# EAGLE design inc_reg16_custom (EAGLE 5.09)
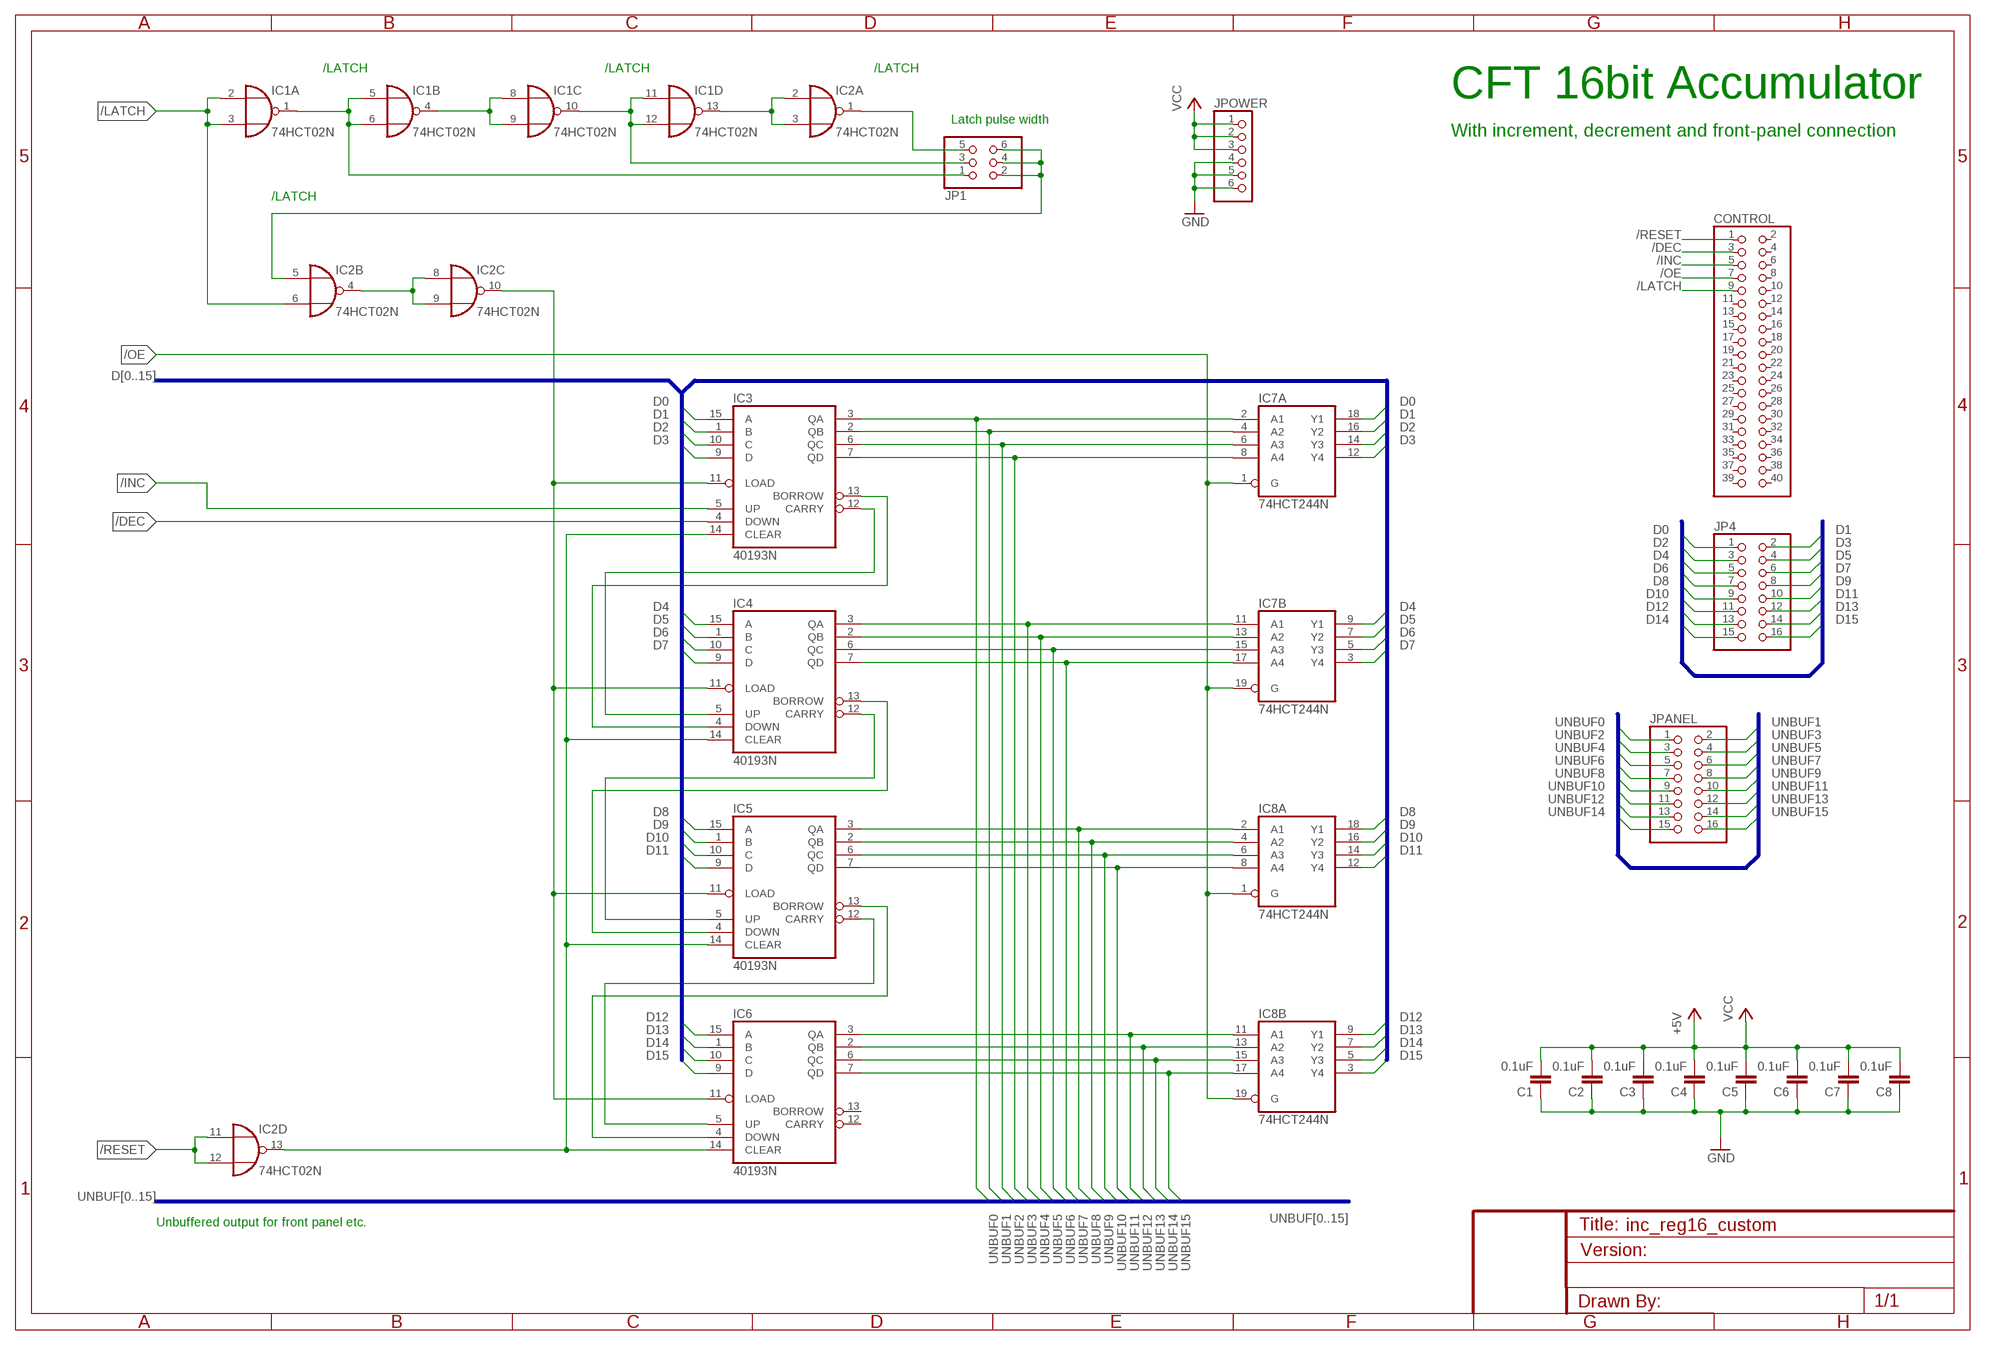
[diagram p0: schematic, sheet 1]

## Parts
C1  0.1uF  C-EU025-024X044  [C025-024X044]
C2  0.1uF  C-EU025-024X044  [C025-024X044]
C3  0.1uF  C-EU025-024X044  [C025-024X044]
C4  0.1uF  C-EU025-024X044  [C025-024X044]
C5  0.1uF  C-EU025-024X044  [C025-024X044]
C6  0.1uF  C-EU025-024X044  [C025-024X044]
C7  0.1uF  C-EU025-024X044  [C025-024X044]
C8  0.1uF  C-EU025-024X044  [C025-024X044]
CONTROL  PINHD-2X20  [2X20]
IC1  74HCT02N  [DIL14]
IC2  74HCT02N  [DIL14]
IC3  40193N  [DIL16]
IC4  40193N  [DIL16]
IC5  40193N  [DIL16]
IC6  40193N  [DIL16]
IC7  74HCT244N  [DIL20]
IC8  74HCT244N  [DIL20]
JP1  PINHD-2X3/90  [2X03/90]
JP4  PINHD-2X8  [2X08]
JPANEL  PINHD-2X8/90  [2X08/90]
JPOWER  PINHD-1X6  [1X06]

## Nets
/DEC: CONTROL.3 IC3.4(DOWN)
/INC: CONTROL.5 IC3.5(UP)
/LATCH: CONTROL.9 IC1.2(A:I0) IC1.3(A:I1) IC2.6(B:I1)
/OE: CONTROL.7 IC7.1(A:G) IC7.19(B:G) IC8.1(A:G) IC8.19(B:G)
/RESET: CONTROL.1 IC2.11(D:I0) IC2.12(D:I1)
D0: IC3.15(A) IC7.18(A:Y1) JP4.1
D1: IC3.1(B) IC7.16(A:Y2) JP4.2
D2: IC3.10(C) IC7.14(A:Y3) JP4.3
D3: IC3.9(D) IC7.12(A:Y4) JP4.4
D4: IC4.15(A) IC7.9(B:Y1) JP4.5
D5: IC4.1(B) IC7.7(B:Y2) JP4.6
D6: IC4.10(C) IC7.5(B:Y3) JP4.7
D7: IC4.9(D) IC7.3(B:Y4) JP4.8
D8: IC5.15(A) IC8.18(A:Y1) JP4.9
D9: IC5.1(B) IC8.16(A:Y2) JP4.10
D10: IC5.10(C) IC8.14(A:Y3) JP4.11
D11: IC5.9(D) IC8.12(A:Y4) JP4.12
D12: IC6.15(A) IC8.9(B:Y1) JP4.13
D13: IC6.1(B) IC8.7(B:Y2) JP4.14
D14: IC6.10(C) IC8.5(B:Y3) JP4.15
D15: IC6.9(D) IC8.3(B:Y4) JP4.16
GND: C1.1 C2.1 C3.1 C4.1 C5.1 C6.1 C7.1 C8.1 JPOWER.4 JPOWER.5 JPOWER.6
N$17: IC1.1(A:O) IC1.5(B:I0) IC1.6(B:I1) JP1.1
N$18: IC1.4(B:O) IC1.8(C:I0) IC1.9(C:I1)
N$19: IC1.10(C:O) IC1.11(D:I0) IC1.12(D:I1) JP1.3
N$20: IC1.13(D:O) IC2.2(A:I0) IC2.3(A:I1)
N$21: IC2.1(A:O) JP1.5
N$22: IC2.5(B:I0) JP1.2 JP1.4 JP1.6
N$23: IC2.4(B:O) IC2.8(C:I0) IC2.9(C:I1)
N$24: IC2.10(C:O) IC3.11(LOAD) IC4.11(LOAD) IC5.11(LOAD) IC6.11(LOAD)
N$25: IC3.12(CARRY) IC4.5(UP)
N$26: IC2.13(D:O) IC3.14(CLEAR) IC4.14(CLEAR) IC5.14(CLEAR) IC6.14(CLEAR)
N$27: IC3.13(BORROW) IC4.4(DOWN)
N$28: IC4.13(BORROW) IC5.4(DOWN)
N$29: IC4.12(CARRY) IC5.5(UP)
N$30: IC5.13(BORROW) IC6.4(DOWN)
N$31: IC5.12(CARRY) IC6.5(UP)
UNBUF0: IC3.3(QA) IC7.2(A:A1)
UNBUF1: IC3.2(QB) IC7.4(A:A2) JPANEL.2
UNBUF2: IC3.6(QC) IC7.6(A:A3) JPANEL.3
UNBUF3: IC3.7(QD) IC7.8(A:A4) JPANEL.4
UNBUF4: IC4.3(QA) IC7.11(B:A1) JPANEL.5
UNBUF5: IC4.2(QB) IC7.13(B:A2) JPANEL.6
UNBUF6: IC4.6(QC) IC7.15(B:A3) JPANEL.7
UNBUF7: IC4.7(QD) IC7.17(B:A4) JPANEL.8
UNBUF8: IC5.3(QA) IC8.2(A:A1) JPANEL.9
UNBUF9: IC5.2(QB) IC8.4(A:A2) JPANEL.10
UNBUF10: IC5.6(QC) IC8.6(A:A3) JPANEL.11
UNBUF11: IC5.7(QD) IC8.8(A:A4) JPANEL.12
UNBUF12: IC6.3(QA) IC8.11(B:A1) JPANEL.13
UNBUF13: IC6.2(QB) IC8.13(B:A2) JPANEL.14
UNBUF14: IC6.6(QC) IC8.15(B:A3) JPANEL.15
UNBUF15: IC6.7(QD) IC8.17(B:A4) JPANEL.16
VCC: C1.2 C2.2 C3.2 C4.2 C5.2 C6.2 C7.2 C8.2 JPOWER.1 JPOWER.2 JPOWER.3 ; supply symbol labelled +5V
Unconnected: CONTROL.2 CONTROL.4 CONTROL.6 CONTROL.8 CONTROL.10 CONTROL.11 CONTROL.12 CONTROL.13 CONTROL.14 CONTROL.15 CONTROL.16 CONTROL.17 CONTROL.18 CONTROL.19 CONTROL.20 CONTROL.21 CONTROL.22 CONTROL.23 CONTROL.24 CONTROL.25 CONTROL.26 CONTROL.27 CONTROL.28 CONTROL.29 CONTROL.30 CONTROL.31 CONTROL.32 CONTROL.33 CONTROL.34 CONTROL.35 CONTROL.36 CONTROL.37 CONTROL.38 CONTROL.39 CONTROL.40 IC6.12(CARRY) IC6.13(BORROW) JPANEL.1

## Buses
D[0..15]
UNBUF[0..15]

## Notes on the sheet
- /LATCH | /LATCH | /LATCH
- CFT 16bit Accumulator
- Latch pulse width
- With increment, decrement and front-panel connection
- /LATCH
- Unbuffered output for front panel etc.

## Power pins joined to a net without a drawn wire
GND: IC1.7(P:GND) IC2.7(P:GND) IC7.10(P:GND) IC8.10(P:GND)
VCC: IC1.14(P:VCC) IC2.14(P:VCC) IC7.20(P:VCC) IC8.20(P:VCC)
VDD: IC3.16(VDD) IC4.16(VDD) IC5.16(VDD) IC6.16(VDD)
VSS: IC3.8(VSS) IC4.8(VSS) IC5.8(VSS) IC6.8(VSS)

## Library data of the parts
C1-C8 = rcl:C-EU: CAPACITOR, European symbol
CONTROL = pinhead:PINHD-2X20: PIN HEADER
IC1 IC2 = 74xx-eu:74*02: Quad 2-input NOR gate
IC3-IC6 = 40xx:40193: Binary up down COUNTER
IC7 IC8 = 74xx-eu:74*244: Octal BUFFER and LINE DRIVER, 3-state
JP1 = pinhead:PINHD-2X3: PIN HEADER
JP4 JPANEL = pinhead:PINHD-2X8: PIN HEADER
JPOWER = pinhead:PINHD-1X6: PIN HEADER

## Board
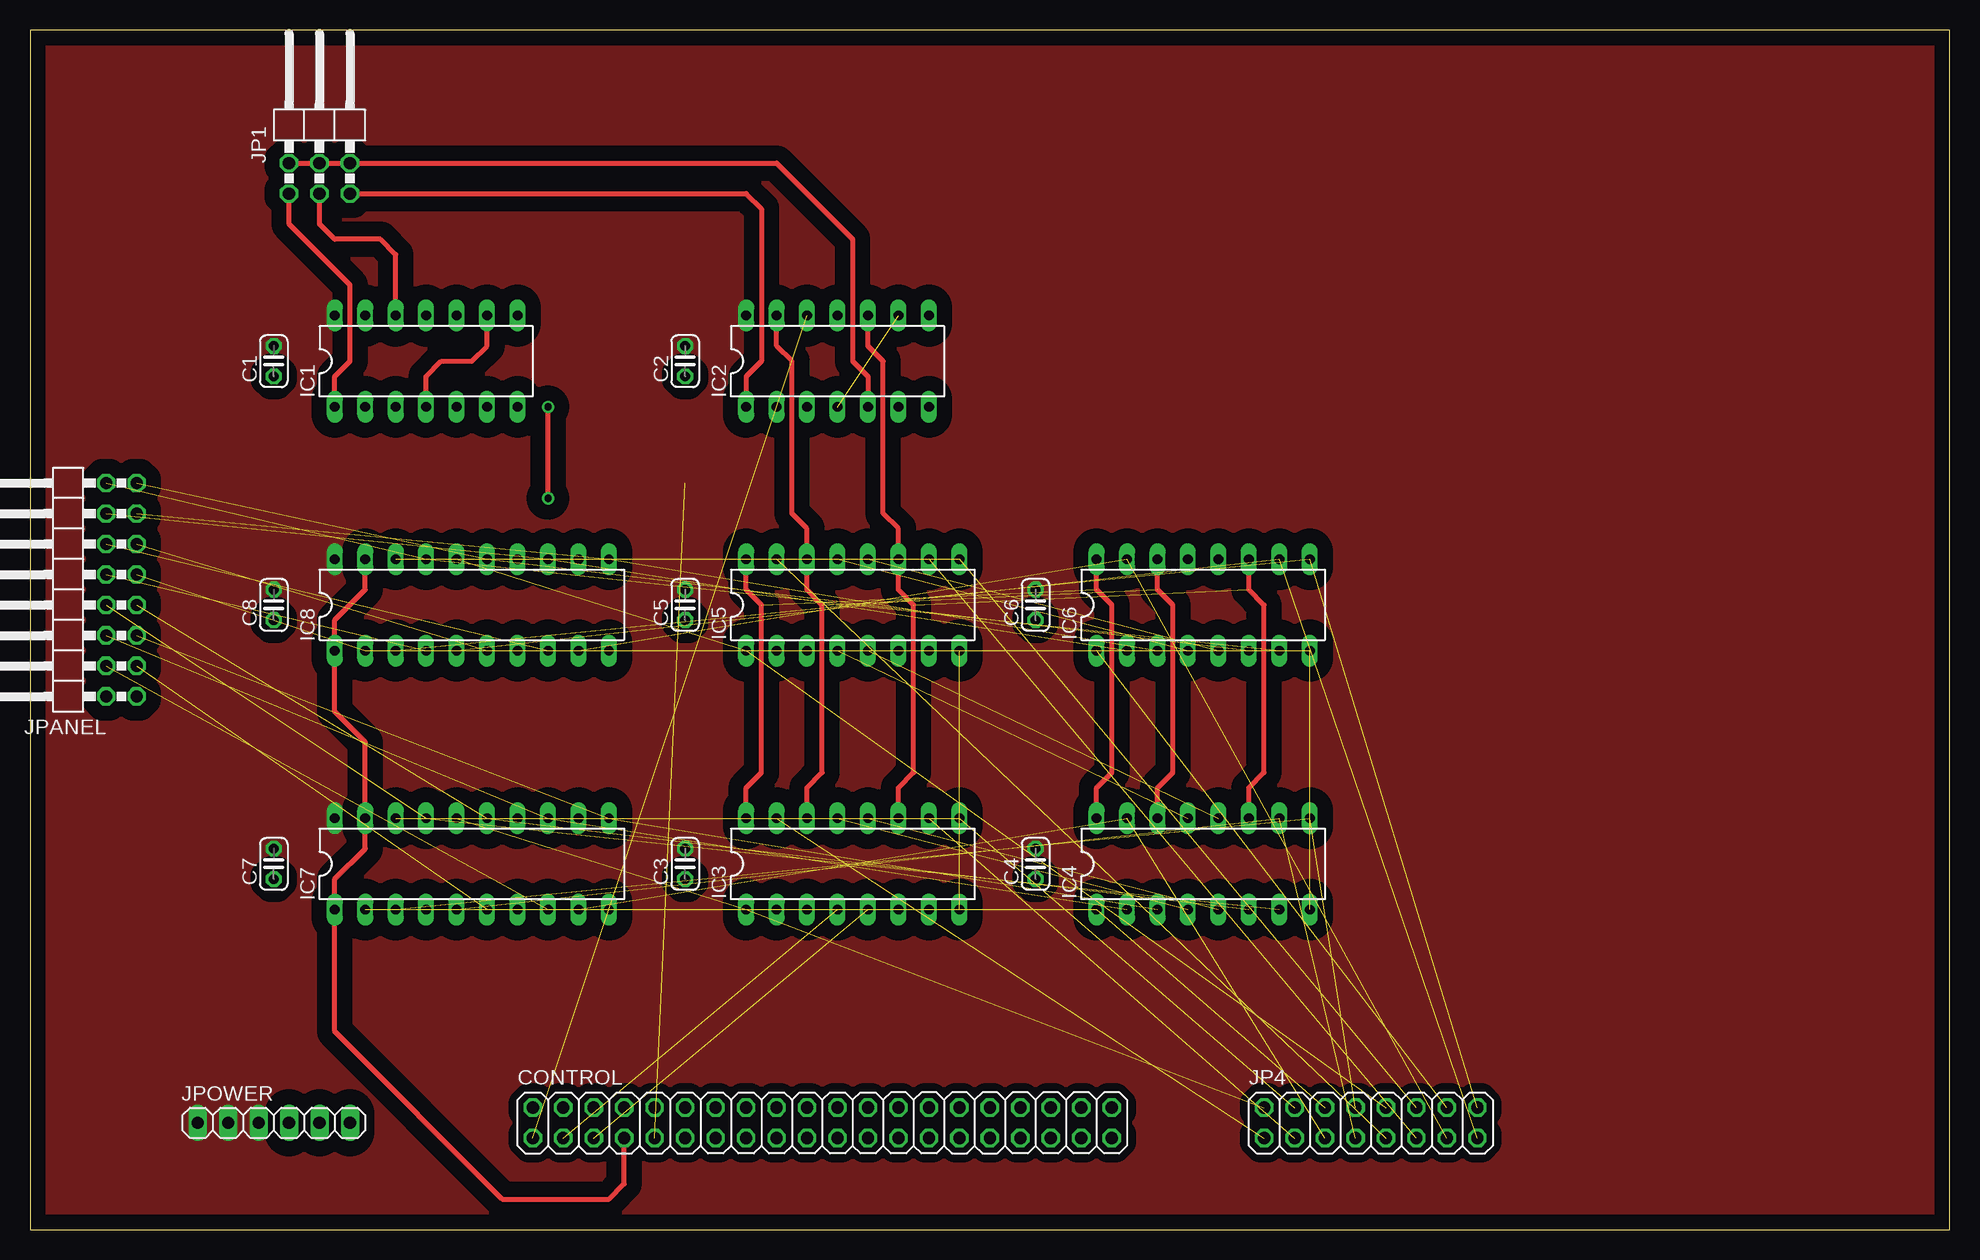
[diagram p1: board, top side]
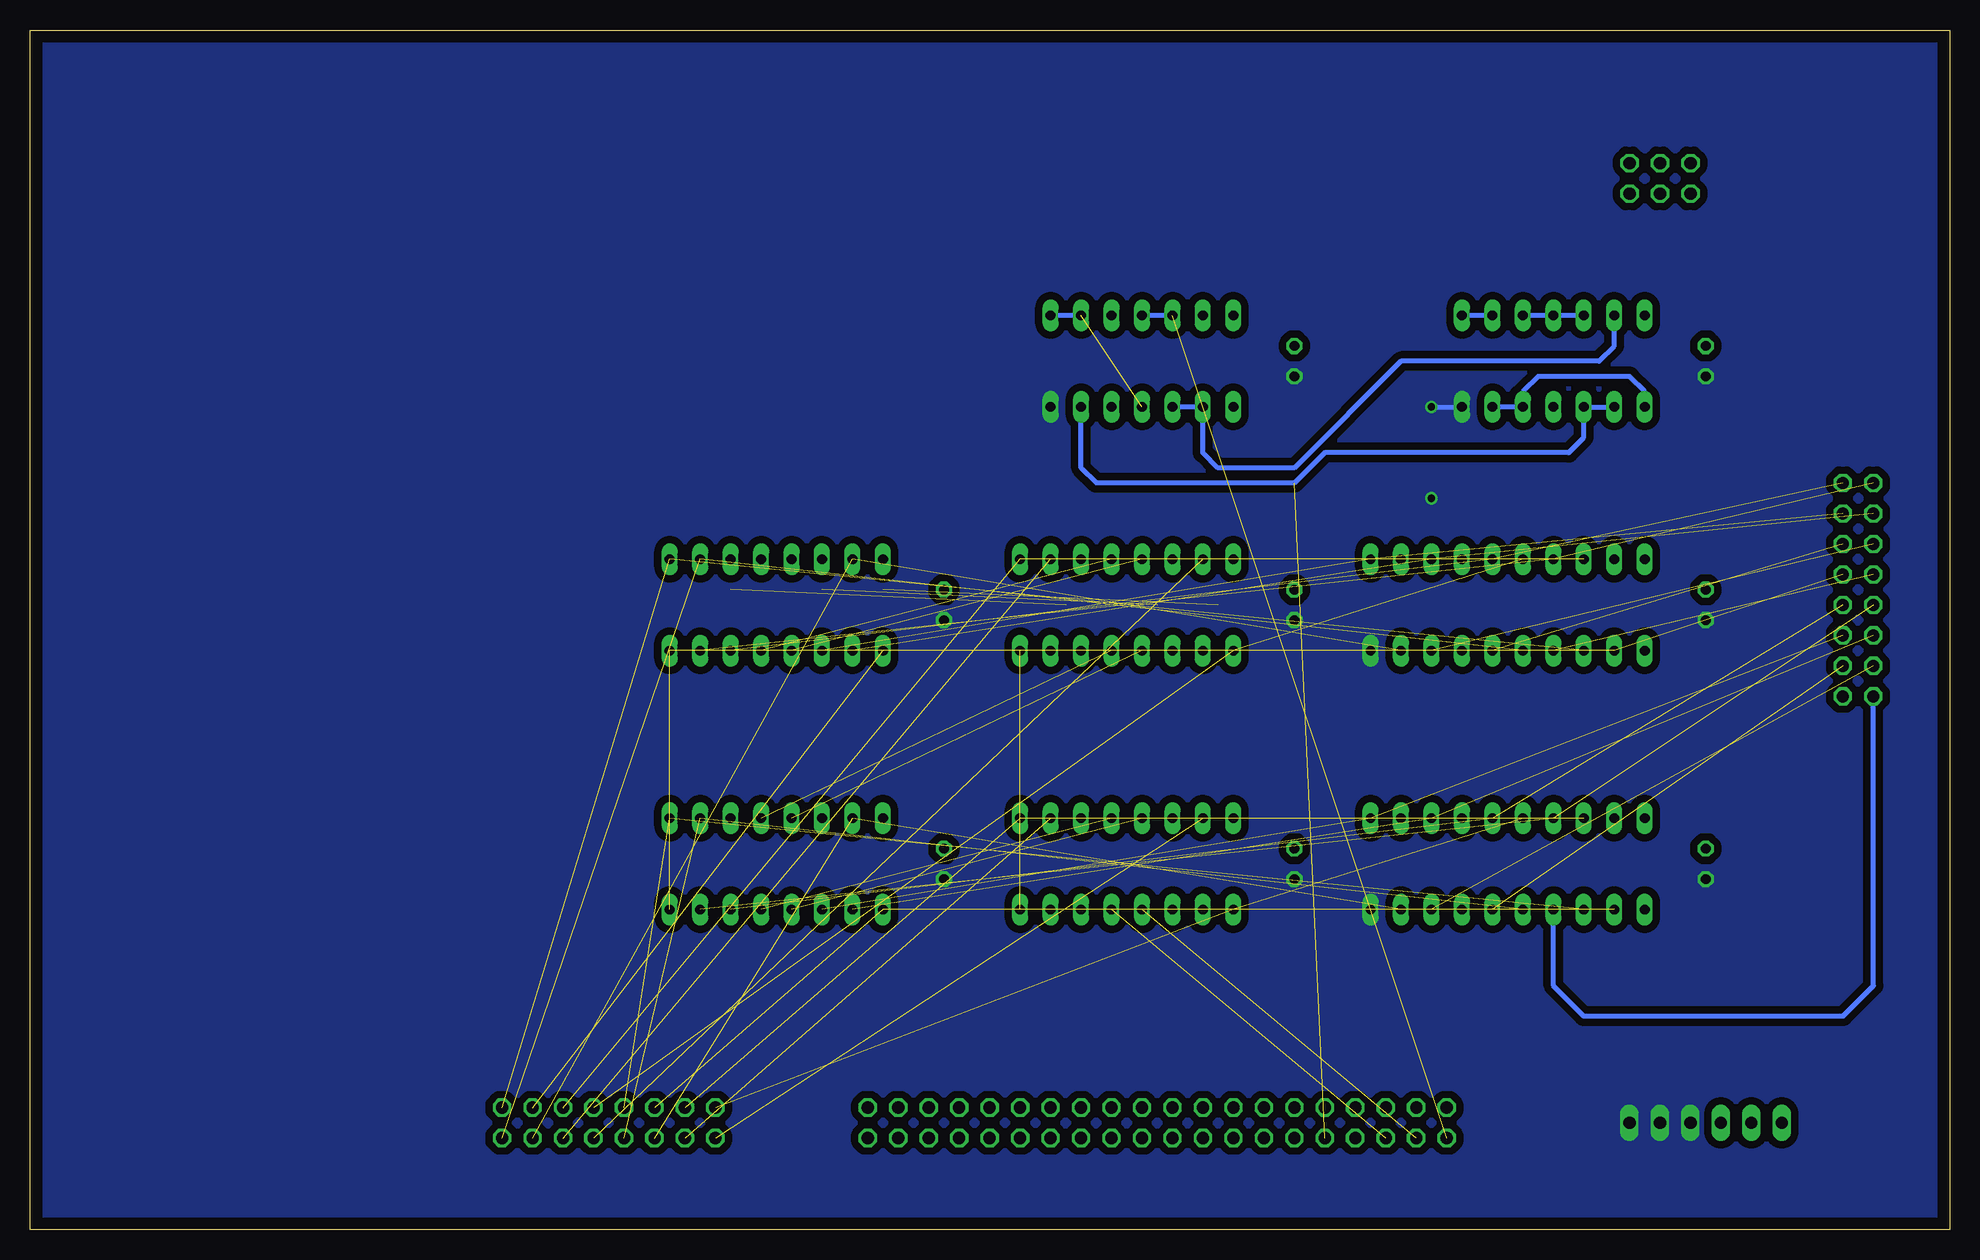
[diagram p2: board, bottom side, seen from below]

Size 160 x 100 mm. Coordinates in mm from the lower left corner, seen from the top.
Outline: 0,0 160,0 160,100 0,100 0,0
Copper layers (1*16): Top 0.035mm / dielectric 1.5mm / Bottom 0.035mm
Design rules "default": minimum track width 10mil, minimum drill 24mil, track to track 8mil, track to pad 8mil, pad to pad 8mil, via to via 8mil, smd to smd 8mil, copper to edge 40mil, drill to drill 8mil, minimum pad ring 10mil, minimum via ring 8mil, stop-mask expansion 4mil, vias tented up to drill 0mil, thermal gap 10mil

### Footprints (pad centres in the part's own frame; a part is rotated, then mirrored left to right if it is on the bottom)
C025-024X044 = drill 0.813 octagon: 1 -1.27,0; 2 1.27,0
2X20 = drill 1.016 octagon: 1 -24.13,-1.27; 2 -24.13,1.27; 3 -21.59,-1.27; 4 -21.59,1.27; 5 -19.05,-1.27; 6 -19.05,1.27; 7 -16.51,-1.27; 8 -16.51,1.27; 9 -13.97,-1.27; 10 -13.97,1.27; 11 -11.43,-1.27; 12 -11.43,1.27; 13 -8.89,-1.27; 14 -8.89,1.27; 15 -6.35,-1.27; 16 -6.35,1.27; 17 -3.81,-1.27; 18 -3.81,1.27; 19 -1.27,-1.27; 20 -1.27,1.27; 21 1.27,-1.27; 22 1.27,1.27; 23 3.81,-1.27; 24 3.81,1.27; 25 6.35,-1.27; 26 6.35,1.27; 27 8.89,-1.27; 28 8.89,1.27; 29 11.43,-1.27; 30 11.43,1.27; 31 13.97,-1.27; 32 13.97,1.27; 33 16.51,-1.27; 34 16.51,1.27; 35 19.05,-1.27; 36 19.05,1.27; 37 21.59,-1.27; 38 21.59,1.27; 39 24.13,-1.27; 40 24.13,1.27
DIL14 = drill 0.813 long: 1 -7.62,-3.81; 2 -5.08,-3.81; 3 -2.54,-3.81; 4 0,-3.81; 5 2.54,-3.81; 6 5.08,-3.81; 7 7.62,-3.81; 8 7.62,3.81; 9 5.08,3.81; 10 2.54,3.81; 11 0,3.81; 12 -2.54,3.81; 13 -5.08,3.81; 14 -7.62,3.81
DIL16 = drill 0.813 long: 1 -8.89,-3.81; 2 -6.35,-3.81; 3 -3.81,-3.81; 4 -1.27,-3.81; 5 1.27,-3.81; 6 3.81,-3.81; 7 6.35,-3.81; 8 8.89,-3.81; 9 8.89,3.81; 10 6.35,3.81; 11 3.81,3.81; 12 1.27,3.81; 13 -1.27,3.81; 14 -3.81,3.81; 15 -6.35,3.81; 16 -8.89,3.81
DIL20 = drill 0.813 long: 1 -11.43,-3.81; 2 -8.89,-3.81; 3 -6.35,-3.81; 4 -3.81,-3.81; 5 -1.27,-3.81; 6 1.27,-3.81; 7 3.81,-3.81; 8 6.35,-3.81; 9 8.89,-3.81; 10 11.43,-3.81; 11 11.43,3.81; 12 8.89,3.81; 13 6.35,3.81; 14 3.81,3.81; 15 1.27,3.81; 16 -1.27,3.81; 17 -3.81,3.81; 18 -6.35,3.81; 19 -8.89,3.81; 20 -11.43,3.81
2X03/90 = drill 1.016 octagon: 1 -2.54,-6.35; 2 -2.54,-3.81; 3 0,-6.35; 4 0,-3.81; 5 2.54,-6.35; 6 2.54,-3.81
2X08 = drill 1.016 octagon: 1 -8.89,-1.27; 2 -8.89,1.27; 3 -6.35,-1.27; 4 -6.35,1.27; 5 -3.81,-1.27; 6 -3.81,1.27; 7 -1.27,-1.27; 8 -1.27,1.27; 9 1.27,-1.27; 10 1.27,1.27; 11 3.81,-1.27; 12 3.81,1.27; 13 6.35,-1.27; 14 6.35,1.27; 15 8.89,-1.27; 16 8.89,1.27
2X08/90 = drill 1.016 octagon: 1 -8.89,-6.35; 2 -8.89,-3.81; 3 -6.35,-6.35; 4 -6.35,-3.81; 5 -3.81,-6.35; 6 -3.81,-3.81; 7 -1.27,-6.35; 8 -1.27,-3.81; 9 1.27,-6.35; 10 1.27,-3.81; 11 3.81,-6.35; 12 3.81,-3.81; 13 6.35,-6.35; 14 6.35,-3.81; 15 8.89,-6.35; 16 8.89,-3.81
1X06 = drill 1.016 long: 1 -6.35,0; 2 -3.81,0; 3 -1.27,0; 4 1.27,0; 5 3.81,0; 6 6.35,0

### Placement (x,y rotation side)
C1  20.32,72.39 90 top
C2  54.61,72.39 90 top
C3  54.61,30.48 90 top
C4  83.82,30.48 90 top
C5  54.61,52.07 90 top
C6  83.82,52.07 90 top
C7  20.32,30.48 90 top
C8  20.32,52.07 90 top
CONTROL  66.04,8.89 0 top
IC1  33.02,72.39 0 top
IC2  67.31,72.39 0 top
IC3  68.58,30.48 0 top
IC4  97.79,30.48 0 top
IC5  68.58,52.07 0 top
IC6  97.79,52.07 0 top
IC7  36.83,30.48 0 top
IC8  36.83,52.07 0 top
JP1  24.13,92.71 0 top
JP4  111.76,8.89 0 top
JPANEL  2.54,53.34 90 top
JPOWER  20.32,8.89 0 top

### Tracks (layer width: path | path; a pad name or v marks a point on that pad's centre or on a via)
/DEC  (1 unrouted)
/INC  (1 unrouted)
/LATCH  (1 unrouted)
  Bottom 0.406: IC1.2 IC1.3 30.48,66.04 31.75,64.77 52.07,64.77 54.61,62.23 71.12,62.23 72.39,63.5 IC2.6
/OE
  Top 0.406: CONTROL.7 49.53,3.81 48.26,2.54 39.37,2.54 25.4,16.51 IC7.1 25.4,29.21 27.94,31.75 IC7.19 27.94,40.64 25.4,43.18 IC8.1 25.4,50.8 27.94,53.34 IC8.19
/RESET  (1 unrouted)
  Bottom 0.406: IC2.12 IC2.11
D0  (2 unrouted)
D1  (2 unrouted)
D2  (2 unrouted)
D3  (2 unrouted)
D4  (2 unrouted)
D5  (2 unrouted)
D6  (2 unrouted)
D7  (2 unrouted)
D8  (2 unrouted)
D9  (2 unrouted)
D10  (2 unrouted)
D11  (2 unrouted)
D12  (2 unrouted)
D13  (2 unrouted)
D14  (2 unrouted)
D15  (2 unrouted)
GND  (via drill 0.6)
  Top 0.406: v43.18,60.96 v43.18,68.58
  Bottom 0.406: v43.18,68.58 IC1.7
  pour Bottom (isolate 0.635, no thermals): 0,99.06 0,0 160.02,0 160.02,99.06
N$17
  Top 0.406: JP1.1 21.59,83.82 26.67,78.74 26.67,72.39 25.4,71.12 IC1.1
  Bottom 0.406: IC1.6 IC1.5 35.56,69.85 34.29,71.12 26.67,71.12 25.4,69.85 IC1.1
N$18
  Top 0.406: IC1.9 38.1,73.66 36.83,72.39 34.29,72.39 33.02,71.12 IC1.4
  Bottom 0.406: IC1.9 IC1.8
N$19
  Top 0.406: JP1.3 24.13,83.82 25.4,82.55 29.21,82.55 30.48,81.28 IC1.12
  Bottom 0.406: IC1.12 IC1.11 IC1.10
N$20
  Bottom 0.406: IC1.13 27.94,73.66 29.21,72.39 45.72,72.39 54.61,63.5 60.96,63.5 62.23,64.77 IC2.2 IC2.3
N$21
  Top 0.406: JP1.5 59.69,86.36 60.96,85.09 60.96,72.39 59.69,71.12 IC2.1
N$22
  Top 0.406: JP1.2 JP1.4 JP1.6 62.23,88.9 68.58,82.55 68.58,72.39 69.85,71.12 IC2.5
N$23  (1 unrouted)
  Bottom 0.406: IC2.9 IC2.8
N$24  (1 unrouted)
  Top 0.406: IC2.10 69.85,73.66 71.12,72.39 71.12,59.69 72.39,58.42 IC5.11 72.39,53.34 73.66,52.07 73.66,38.1 72.39,36.83 IC3.11 | IC6.11 101.6,53.34 102.87,52.07 102.87,38.1 101.6,36.83 IC4.11
N$25  (1 unrouted)
N$26  (1 unrouted)
  Top 0.406: IC2.13 62.23,73.66 63.5,72.39 63.5,59.69 64.77,58.42 IC5.14 64.77,53.34 66.04,52.07 66.04,38.1 64.77,36.83 IC3.14 | IC6.14 93.98,53.34 95.25,52.07 95.25,38.1 93.98,36.83 IC4.14
N$27  (1 unrouted)
N$28  (1 unrouted)
N$29  (1 unrouted)
N$30  (1 unrouted)
N$31  (1 unrouted)
UNBUF0  (1 unrouted)
UNBUF1  (1 unrouted)
  Bottom 0.406: JPANEL.2 6.35,20.32 8.89,17.78 30.48,17.78 33.02,20.32 IC7.4
UNBUF2  (2 unrouted)
UNBUF3  (2 unrouted)
UNBUF4  (2 unrouted)
UNBUF5  (2 unrouted)
UNBUF6  (2 unrouted)
UNBUF7  (2 unrouted)
UNBUF8  (2 unrouted)
UNBUF9  (2 unrouted)
UNBUF10  (2 unrouted)
UNBUF11  (2 unrouted)
UNBUF12  (2 unrouted)
UNBUF13  (2 unrouted)
UNBUF14  (2 unrouted)
UNBUF15  (2 unrouted)
VCC
  pour Top (isolate 1.27, no thermals): 1.27,99.06 1.27,0 160.02,0 160.02,99.06
VDD  (1 unrouted)
  Top 0.406: IC5.16 59.69,53.34 60.96,52.07 60.96,38.1 59.69,36.83 IC3.16 | IC6.16 88.9,53.34 90.17,52.07 90.17,38.1 88.9,36.83 IC4.16
VSS  (3 unrouted)